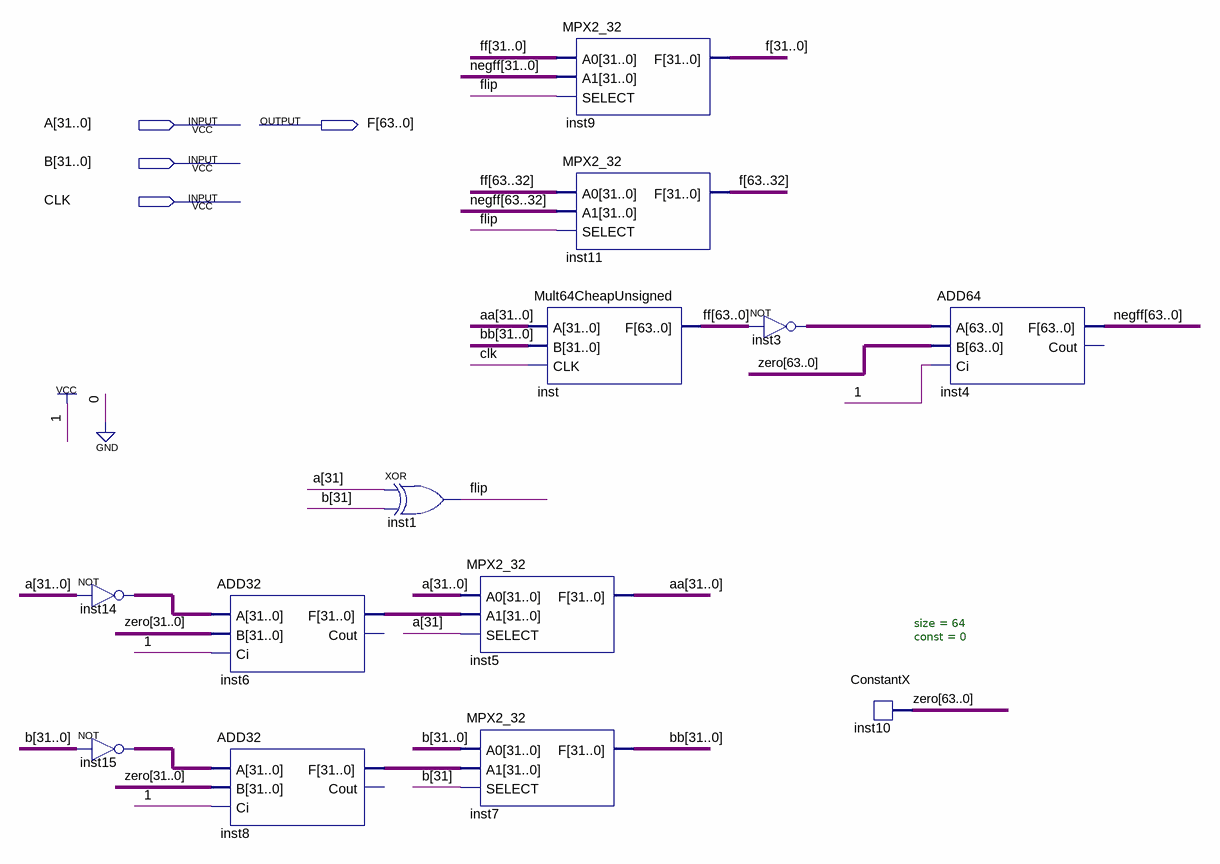
[diagram p0: schematic sheet]
// Quartus schematic Mult64Cheap.bdf as structural Verilog: 13 symbols, 4 pins
module Mult64Cheap (
  input  [31:0] A,
  input  [31:0] B,
  input  CLK,
  output [63:0] F
);

  wire flip;
  wire [31:0] aa, bb, inst6_f, inst8_f, inst14_out, inst15_out;
  wire [63:0] ff, inst3_out, negff, zero;

  assign inst14_out = ~A;  // NOT inst14, 32 bits wide
  assign inst15_out = ~B;  // NOT inst15, 32 bits wide
  ADD32 inst6 (.A(inst14_out), .B(zero[31:0]), .Ci(1'b1), .F(inst6_f));  // open: Cout
  ADD32 inst8 (.A(inst15_out), .B(zero[31:0]), .Ci(1'b1), .F(inst8_f));  // open: Cout
  xor inst1 (flip, A[31], B[31]);
  MPX2_32 inst5 (.A0(A), .A1(inst6_f), .SELECT(A[31]), .F(aa));
  MPX2_32 inst7 (.A0(B), .A1(inst8_f), .SELECT(B[31]), .F(bb));
  Mult64CheapUnsigned inst (.A(aa), .B(bb), .CLK(CLK), .F(ff));
  MPX2_32 inst9 (.A0(ff[31:0]), .A1(negff[31:0]), .SELECT(flip), .F(F[31:0]));
  MPX2_32 inst11 (.A0(ff[63:32]), .A1(negff[63:32]), .SELECT(flip), .F(F[63:32]));
  assign inst3_out = ~ff;  // NOT inst3, 64 bits wide
  ConstantX #(.size(64), .\const (0)) inst10 (.DATA_OUT(zero));
  ADD64 inst4 (.A(inst3_out), .B(zero), .Ci(1'b1), .F(negff));  // open: Cout
endmodule
